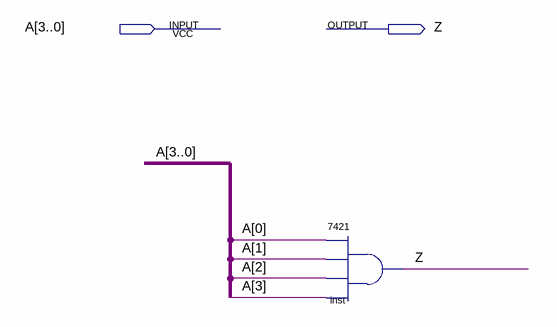
[diagram p0: schematic sheet]
// Quartus schematic and_4in.bdf as structural Verilog: 1 symbols, 2 pins
module and_4in (
  input  [3:0] A,
  output Z
);

  \7421  inst (.\5 (A[3]), .\4 (A[2]), .\3 (A[1]), .\2 (A[0]), .\1 (Z));
endmodule
